# Altium schematic sheet ZIGBEE.SchDoc
size A4; SheetNumber: 9; SheetTotal: 10
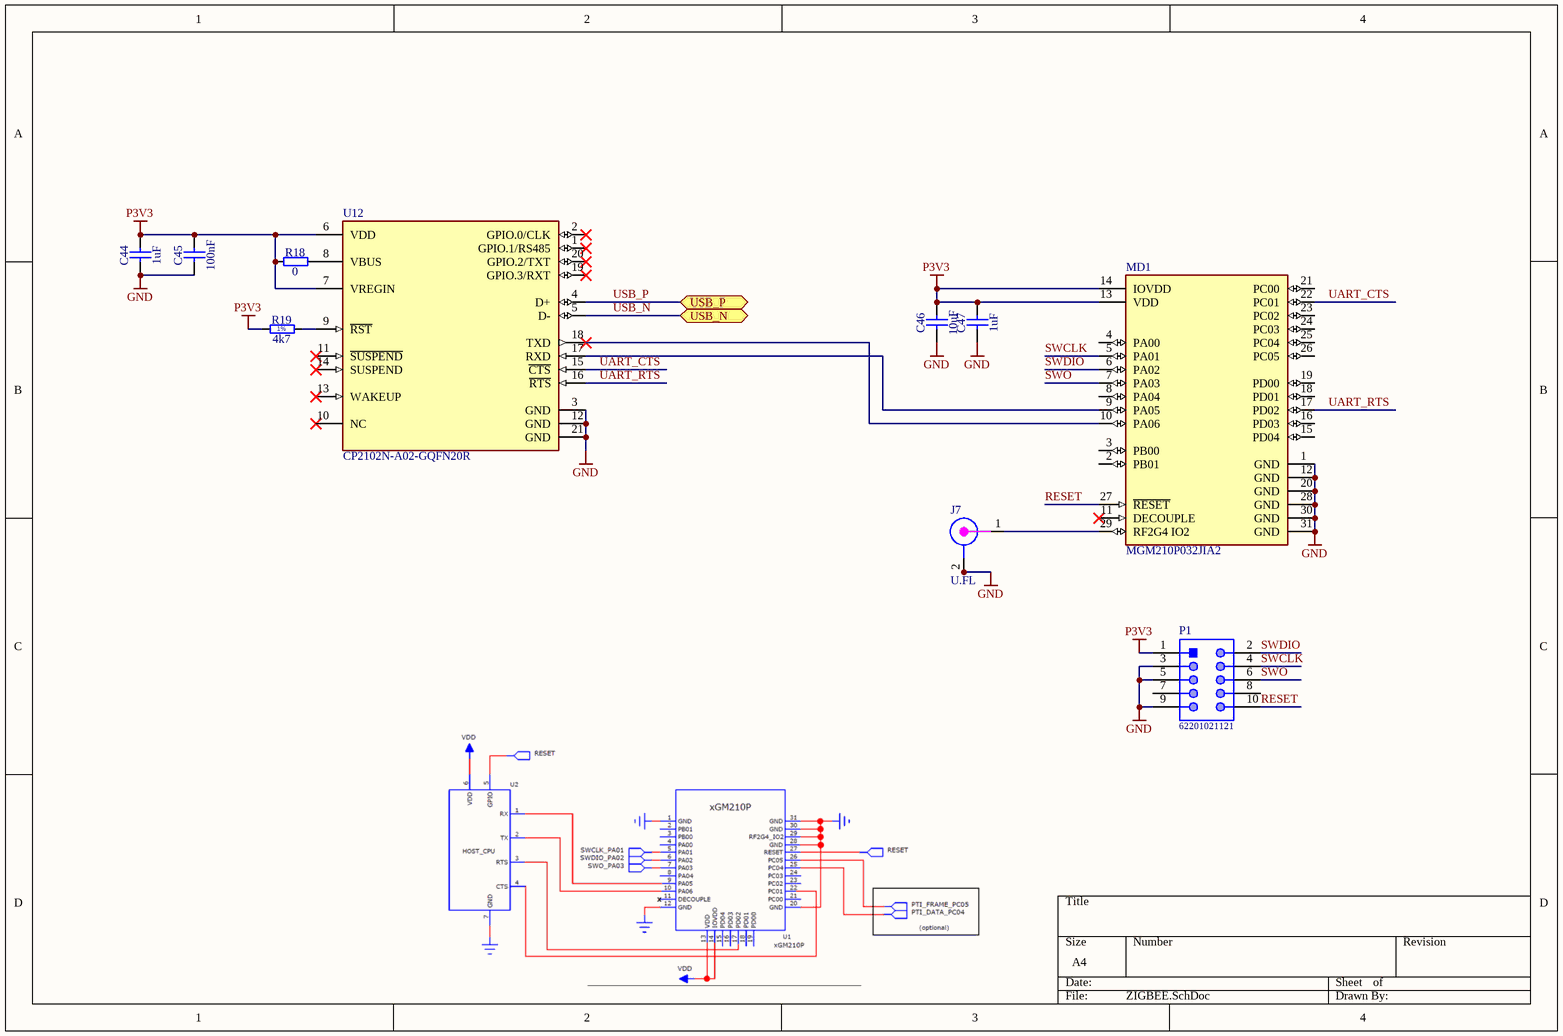
[diagram p0: ZIGBEE.SchDoc]

## Parts
C44  1uF  [CAPC1005X55N]
C45  100nF  [CAPC1005X55N]
C46  10uF  [CAPC2012X95N]
C47  1uF  [CAPC1005X55N]
J7  U.FL  [CON_UFL_HIROSE_RECEPTACLE]
MD1  MGM210P032JIA2  [FP-MGM210P032JIA2-MFG]
P1  62201021121  [62201021121]
R18  0  [RESC1005X40N]
R19  4k7  [RESC1005X40N]
U12  CP2102N-A02-GQFN20R  [FP-CP2102N-A02-GQFN20R-MFG]

## Ports
USB_N (bidir), USB_P (bidir)

## Nets
GND: C44.1 C45.1 C46.1 C47.1 J7.2 J7.2a(GND) MD1.1(GND) MD1.12(GND) MD1.20(GND) MD1.28(GND) MD1.30(GND) MD1.31(GND) P1.3 P1.5 P1.9 U12.3(GND) U12.12(GND) U12.21(GND)
P3V3: C44.2 C45.2 C46.2 C47.2 MD1.13(VDD) MD1.14(IOVDD) P1.1 R18.1 R19.1 U12.6(VDD) U12.7(VREGIN)
RESET: MD1.27(~{RESET}) P1.10
SWCLK: MD1.5(PA01) P1.4
SWDIO: MD1.6(PA02) P1.2
SWO: MD1.7(PA03) P1.6
UART_CTS: MD1.22(PC01) U12.15(~{CTS})
UART_RTS: MD1.17(PD02) U12.16(~{RTS})
USB_N: U12.5(D-) ; port USB_N
USB_P: U12.4(D+) ; port USB_P
NetJ7_1: J7.1 MD1.29(RF2G4_IO2)
NetMD1_9: MD1.9(PA05) U12.17(RXD)
NetMD1_10: MD1.10(PA06) U12.18(TXD)
NetR18_2: R18.2 U12.8(VBUS)
NetR19_2: R19.2 U12.9(~{RST})

Not connected (* = marked no-connect by the designer): MD1 2(PB01) 3(PB00) 4(PA00) 8(PA04) 11(DECOUPLE)* 15(PD04) 16(PD03) 18(PD01) 19(PD00) 21(PC00) 23(PC02) 24(PC03) 25(PC04) 26(PC05); P1 7 8; U12 1(GPIO.1/RS485)* 2(GPIO.0/CLK)* 10(NC)* 11(~{SUSPEND})* 13(WAKEUP)* 14(SUSPEND)* 19(GPIO.3/RXT)* 20(GPIO.2/TXT)*

## Notes on the sheet
- (in symbol R0402_4K7_1%_0.0625W_100PPM) 1%

## Library data of the parts
C44 C47 = CC0402_1UF_16V_10%_X5R: Non-polarised capacitor; Part Description: SMD Multilayer Chip Ceramic Capacitor; Manufacturer: GENERIC; Manufacturer1 Part Number: C1005X5R1C105KT; Voltage: 16V; TC: X5R; Tolerance: ±10%; Part Number: CC0402_1UF_16V_10%_X5R; Component Kind: Standard; Component Type: Standard; Pin Count: 2; Value: 1uF; Status: Preferred; Manufacturer Part Number: CC0402_1UF_16V_10%_X5R; Case: 0402; Mounted: Yes; Socket: No; SMD: Yes; Sense: No; Manufacturer1 Example: TDK; Manufacturer1 ComponentHeight: 0.55mm; HelpURL: \\cern.ch\dfs\Applications\Altium\Datasheets\CC0402_X5R_TDK_C.pdf; Author: CERN DEM JLC; CreateDate: 25.10.2012; LatestRevisionDate: 25.10.2012
C45 = CC0402_100NF_16V_10%_X5R: Non-polarised capacitor; Part Description: SMD Multilayer Chip Ceramic Capacitor; Manufacturer: GENERIC; Manufacturer1 Part Number: GRM155R61C104KA88D; Voltage: 16V; TC: X5R; Tolerance: ±10%; Part Number: CC0402_100NF_16V_10%_X5R; Component Kind: Standard; Component Type: Standard; Pin Count: 2; Value: 100nF; Status: None; Manufacturer Part Number: CC0402_100NF_16V_10%_X5R; Case: 0402; Mounted: Yes; Socket: No; SMD: Yes; Sense: No; Manufacturer1 Example: MURATA; Manufacturer1 ComponentHeight: 0.55mm; HelpURL: \\cern.ch\dfs\Applications\Altium\Datasheets\CC0402_X5R_MURATA_GRM.pdf; Author: CERN DEM JLC; CreateDate: 10.12.2013; LatestRevisionDate: 10.12.2013
C46 = CC0805_10UF_25V_10%_X5R: Non-polarised capacitor; Part Description: SMD Multilayer Chip Ceramic Capacitor; Manufacturer: GENERIC; Manufacturer1 Part Number: GRM219R61E106KA12D; Voltage: 25V; TC: X5R; Tolerance: ±10%; Part Number: CC0805_10UF_25V_10%_X5R; Component Kind: Standard; Component Type: Standard; Pin Count: 2; Value: 10uF; Status: Preferred; Manufacturer Part Number: CC0805_10UF_25V_10%_X5R; Case: 0805; Mounted: Yes; Socket: No; SMD: Yes; Sense: No; Manufacturer1 Example: MURATA; Manufacturer1 ComponentHeight: 0.95mm; HelpURL: \\cern.ch\dfs\Applications\Altium\Datasheets\CC0805_X5R_MURATA_GRM.pdf; Author: CERN DEM JLC; CreateDate: 25.10.2012; LatestRevisionDate: 06.09.2016
J7 = CON_UFL_SMD: UFL; Supplier 1: Newark; Supplier Part Number 1: 50P8856
MD1 = CMP-08140-000013-1: RX TXRX MOD BLUETOOTH CHIP SMD; Manufacturer Part Number: MGM210P032JIA2 or MGM210P032JIA2; Manufacturer: Silicon Labs; Transmitting Current: 181.3mA; Max Frequency: 2483.5MHz; Data Rate: 2Mbits/s; Max Supply Voltage: 3.8V; Receiving Current: 9.4mA; Min Supply Voltage: 1.71V; Sensitivity: -103.9dBm; Bandwidth: 83.5MHz; Interface: I2C,SPI,UART,USART,IrDA,I2S,Other; Number Of Gpio: 20; ComponentLink2URL: https://www.silabs.com/documents/public/data-sheets/mgm210p-datasheet.pdf; Ambient Temperature Range High: +125°C; Octopart: https://octopart.com/mgm210p032jia2-silicon+labs-103954340; Device Class L2: RF Semiconductors and Devices; Category: UNK; Temperature: -40°C to +125°C; Ambient Temperature Range Low: -40°C; Automotive: No; Digikey Description: RX TXRX MOD BLUETOOTH CHIP SMD; Device Class L1: Integrated Circuits (ICs); RoHS: TRUE; Device Class L3: Transceivers; Package: 0; Temperature Range Low: -40°C; Lead Free: Yes; ComponentLink2Description: Datasheet; Height: 2.35mm; Temperature Range High: +125°C
P1 = CMP-1502-00948-1: THT Vertical Pin Header WR-PHD, Pitch 1.27 mm, Dual Row, 10 pins; Manufacturer: Wurth Elektronik; Rated Current: 1A; Pin Number: 10; Working Voltage: 100VAC; Contact Resistance: 20mOhm; Withstanding Voltage: 500VAC; Pitch: 1.27mm; Gender: Male; Mounting Technology: THT; Manufacturer URL: http://www.we-online.de; Package Reference: 62201021121; Row Number: Dual; Datasheet URL: https://katalog.we-online.de/em/datasheet/62201021121.pdf; Publisher: WurthElektronik; Packaging: Box; Operating Temperature: -40to105degC; Orientation: Vertical; Part Number: 62201021121
R18 = R0402_0R_JUMPER: Resistor; Part Description: 1A (0.05R Max DC Resistance) Zero Ohm Jumper; Manufacturer: GENERIC; Manufacturer1 Part Number: 232270591001L; PressFit: No; Part Number: R0402_0R_JUMPER; Component Kind: Standard; Component Type: Standard; Pin Count: 2; Value: 0; Status: Not Recommended; Manufacturer Part Number: R0402_0R_JUMPER; Case: 0402; Mounted: Yes; Sense: No; Socket: No; SMD: Yes; Manufacturer1 Example: YAGEO PHYCOMP; Manufacturer1 ComponentHeight: 0.4mm; HelpURL: \\cern.ch\dfs\Applications\Altium\Datasheets\R0402_Phycomp_RC0402.pdf; Author: CERN DEM JLC; CreateDate: 03.12.2007; LatestRevisionDate: 17.10.2012
R19 = R0402_4K7_1%_0.0625W_100PPM: Resistor - 1%; Part Description: General Purpose Thick Film Chip Resistor; Manufacturer: GENERIC; Manufacturer1 Part Number: 232270674702L; TC: ±100ppm/°C; PressFit: No; Part Number: R0402_4K7_1%_0.0625W_100PPM; Component Kind: Standard; Component Type: Standard; Pin Count: 2; Value: 4k7; Status: Not Recommended; Power: 0.0625W; Tolerance: ±1%; Manufacturer Part Number: R0402_4K7_1%_0.0625W_100PPM; Case: 0402; Mounted: Yes; Sense: No; Socket: No; SMD: Yes; Manufacturer1 Example: YAGEO PHYCOMP; Manufacturer1 ComponentHeight: 0.4mm; HelpURL: \\cern.ch\dfs\Applications\Altium\Datasheets\R0402_Phycomp_RC0402.pdf; Author: CERN DEM JLC; CreateDate: 03.12.2007; LatestRevisionDate: 17.10.2012
U12 = CMP-08107-000007-1: IC USB TO UART BRIDGE QFN20